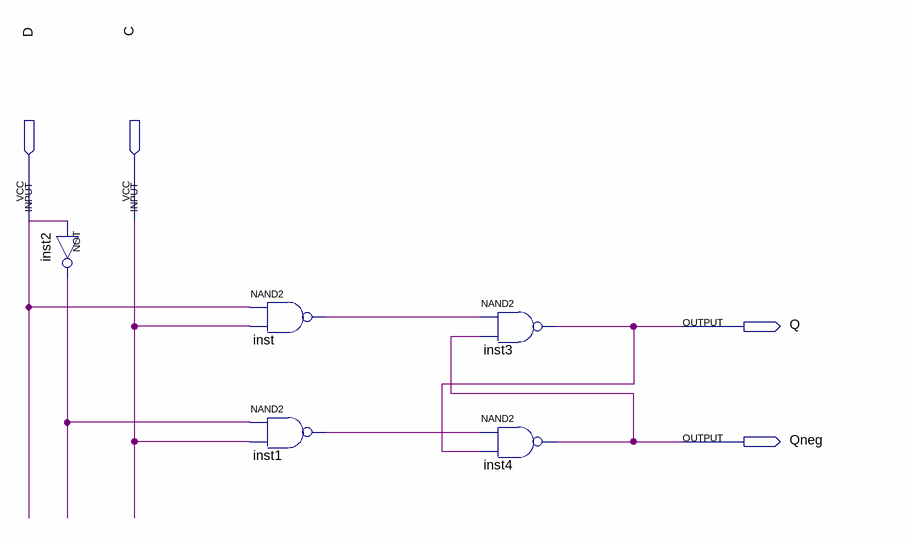
[diagram p0: schematic sheet]
// Quartus schematic FFD.bdf as structural Verilog: 5 symbols, 4 pins
module FFD (
  input  D,
  input  C,
  output Q,
  output Qneg
);

  wire inst1_out, inst2_out, inst_out;

  not inst2 (inst2_out, D);
  nand inst (inst_out, D, C);
  nand inst1 (inst1_out, inst2_out, C);
  nand inst3 (Q, inst_out, Qneg);
  nand inst4 (Qneg, inst1_out, Q);
endmodule
